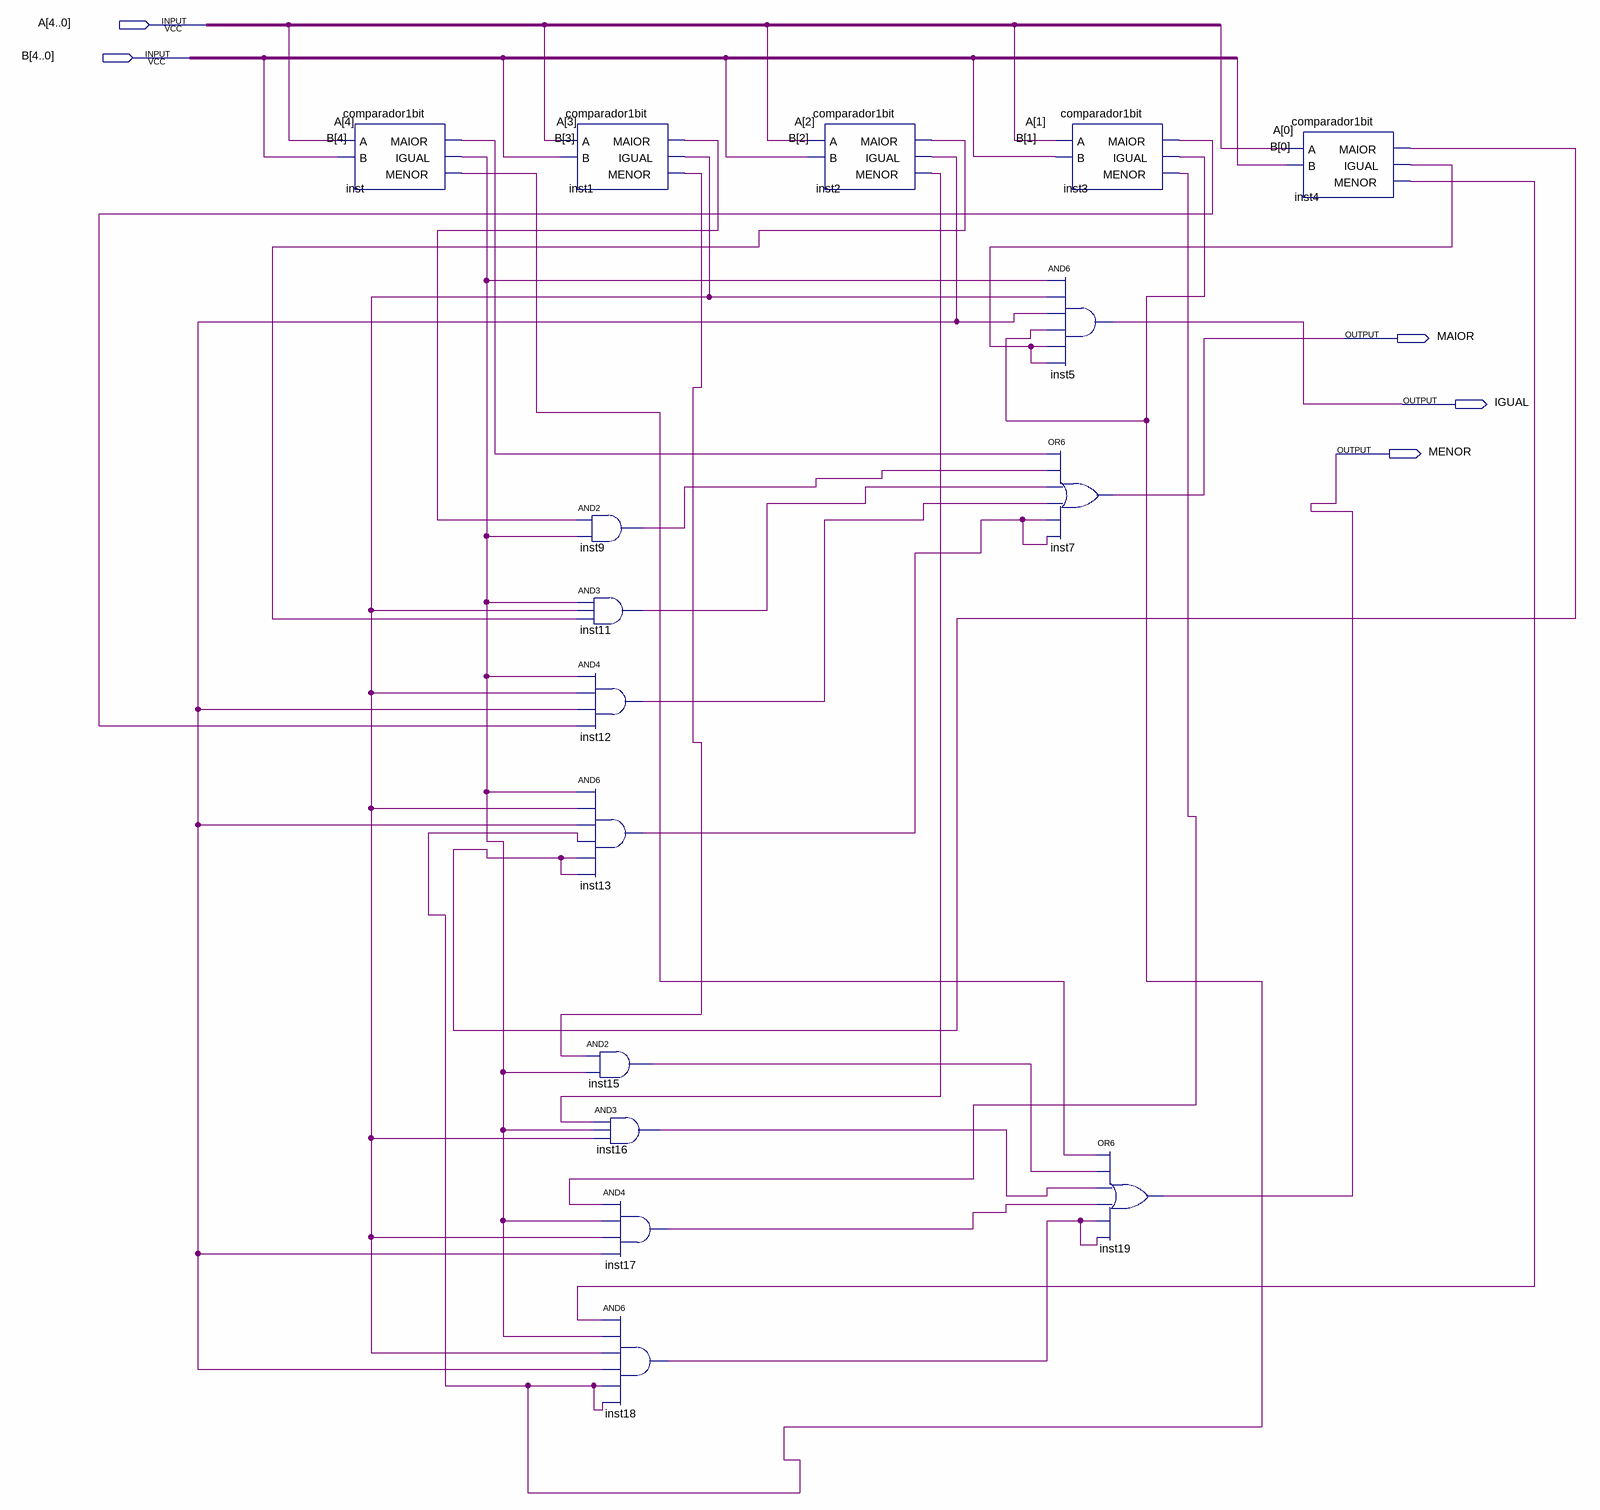
[diagram p0: schematic sheet]
// Quartus schematic comparador5bit.bdf as structural Verilog: 16 symbols, 5 pins
module comparador5bit (
  input  [4:0] A,
  input  [4:0] B,
  output MAIOR,
  output IGUAL,
  output MENOR
);

  wire inst1_igual, inst1_maior, inst1_menor, inst2_igual, inst2_maior, inst2_menor, inst3_igual,
       inst3_maior, inst3_menor, inst4_igual, inst4_maior, inst4_menor, inst9_out, inst11_out, inst12_out,
       inst13_out, inst15_out, inst16_out, inst17_out, inst18_out, inst_igual, inst_maior, inst_menor;

  comparador1bit inst (.A(A[4]), .B(B[4]), .MAIOR(inst_maior), .IGUAL(inst_igual), .MENOR(inst_menor));
  comparador1bit inst1 (.A(A[3]), .B(B[3]), .MAIOR(inst1_maior), .IGUAL(inst1_igual), .MENOR(inst1_menor));
  and inst9 (inst9_out, inst1_maior, inst_igual);
  and inst11 (inst11_out, inst_igual, inst1_igual, inst2_maior);
  and inst12 (inst12_out, inst_igual, inst1_igual, inst2_igual, inst3_maior);
  and inst13 (inst13_out, inst_igual, inst1_igual, inst2_igual, inst3_igual, inst4_maior, inst4_maior);
  and inst15 (inst15_out, inst1_menor, inst_igual);
  and inst16 (inst16_out, inst2_menor, inst_igual, inst1_igual);
  and inst17 (inst17_out, inst3_menor, inst_igual, inst1_igual, inst2_igual);
  and inst18 (inst18_out, inst4_menor, inst_igual, inst1_igual, inst2_igual, inst3_igual, inst3_igual);
  comparador1bit inst2 (.A(A[2]), .B(B[2]), .MAIOR(inst2_maior), .IGUAL(inst2_igual), .MENOR(inst2_menor));
  comparador1bit inst3 (.A(A[1]), .B(B[1]), .MAIOR(inst3_maior), .IGUAL(inst3_igual), .MENOR(inst3_menor));
  and inst5 (IGUAL, inst_igual, inst1_igual, inst2_igual, inst3_igual, inst4_igual, inst4_igual);
  or inst7 (MAIOR, inst_maior, inst9_out, inst11_out, inst12_out, inst13_out, inst13_out);
  or inst19 (MENOR, inst_menor, inst15_out, inst16_out, inst17_out, inst18_out, inst18_out);
  comparador1bit inst4 (.A(A[0]), .B(B[0]), .MAIOR(inst4_maior), .IGUAL(inst4_igual), .MENOR(inst4_menor));
endmodule
